# Altium schematic sheet LED 7 Thanh.SchDoc
size A
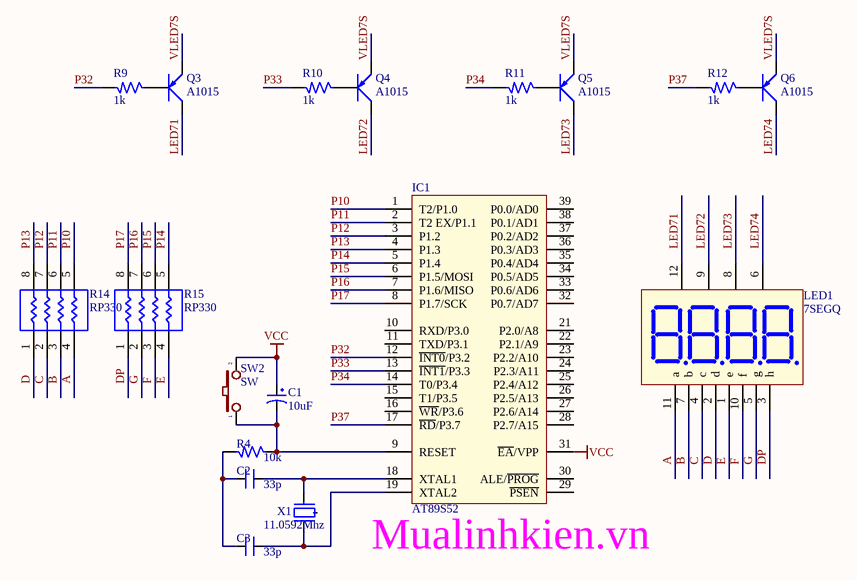
[diagram p0: LED 7 Thanh.SchDoc]

## Parts
C1  10uF  [CP1/2]
C2  33p  [SM-0805]
C3  33p  [SM-0805]
IC1  AT89S52  [ZIP40]
LED1  7SEGQ  [7SEGQ-n]
Q3  A1015  [SOT23B]
Q4  A1015  [SOT23B]
Q5  A1015  [SOT23B]
Q6  A1015  [SOT23B]
R4  10k  [SM-RES-0805]
R9  1k  [SM-RES-0805]
R10  1k  [SM-RES-0805]
R11  1k  [SM-RES-0805]
R12  1k  [SM-RES-0805]
R14  RP330  [RESCAXS50P160X320X70-8N]
R15  RP330  [RESCAXS50P160X320X70-8N]
SW2  SW  [SW-SMD]
X1  11.0592Mhz  [XT3]

## Nets
GND: IC1.20(GND)
VCC: C1.1 IC1.31(~{EA}/VPP) IC1.40(VCC) SW2.2
A: LED1.11(a) R14.4
B: LED1.7(b) R14.3
C: LED1.4(c) R14.2
D: LED1.2(d) R14.1
DP: LED1.3(h) R15.1
E: LED1.1(e) R15.4
F: LED1.10(f) R15.3
G: LED1.5(g) R15.2
LED71: LED1.12(V1) Q3.2(C)
LED72: LED1.9(V2) Q4.2(C)
LED73: LED1.8(V3) Q5.2(C)
LED74: LED1.6(V4) Q6.2(C)
P10: IC1.1(T2/P1.0) R14.5
P11: IC1.2(T2_EX/P1.1) R14.6
P12: IC1.3(P1.2) R14.7
P13: IC1.4(P1.3) R14.8
P14: IC1.5(P1.4) R15.5
P15: IC1.6(P1.5/MOSI) R15.6
P16: IC1.7(P1.6/MISO) R15.7
P17: IC1.8(P1.7/SCK) R15.8
P32: IC1.12(~{INT0}/P3.2) R9.2
P33: IC1.13(~{INT1}/P3.3) R10.2
P34: IC1.14(T0/P3.4) R11.2
P37: IC1.17(~{RD}/P3.7) R12.2
VLED7S: Q3.1(E) Q4.1(E) Q5.1(E) Q6.1(E)
NetC1_2: C1.2 IC1.9(RESET) R4.1 SW2.1
NetC2_1: C2.1 C3.1 R4.2
NetC2_2: C2.2 IC1.18(XTAL1) X1.2
NetC3_2: C3.2 IC1.19(XTAL2) X1.1
NetQ3_3: Q3.3(B) R9.1
NetQ4_3: Q4.3(B) R10.1
NetQ5_3: Q5.3(B) R11.1
NetQ6_3: Q6.3(B) R12.1

Not connected (* = marked no-connect by the designer): IC1 10(RXD/P3.0) 11(TXD/P3.1) 15(T1/P3.5) 16(~{WR}/P3.6) 21(P2.0/A8) 22(P2.1/A9) 23(P2.2/A10) 24(P2.3/A11) 25(P2.4/A12) 26(P2.5/A13) 27(P2.6/A14) 28(P2.7/A15) 29(~{PSEN}) 30(ALE/~{PROG}) 32(P0.7/AD7) 33(P0.6/AD6) 34(P0.5/AD5) 35(P0.4/AD4) 36(P0.3/AD3) 37(P0.2/AD2) 38(P0.1/AD1) 39(P0.0/AD0); X1 3

## Notes on the sheet
- Labels drawn without touching a wire or pin: Mualinhkien.vn

## Library data of the parts
C1 = CP1: Cap P  0,1uF < 22uF , 16 - 50V; Value: 10uF/50V; Description 1: 10 => 220uF/6,3V/10V - 10uF => 100uF/16V; Description 2: 0,1uF => 33uF/50V - 10uF => 22uF/63V; Description 3: 0,47uF => 10uF/100V
C2 C3 = CN1: Cap np  1pF - 472pF; Value: 100pF
IC1 = AT89S52: AT89S52, 8k Byte Flash Memory , 40 Pin; Value: AT89S52
LED1 = LED7Q: Four 7 Seg Dipslay; Value: LED 7Q SEG
Q3-Q6 = A1015: PNP 600mW, ECB; Value: A1015
R4 R9-R12 = R: Resistor 1/4W; Value: R1/4W - 1K
R14 R15 = ResPack
SW2 = SW2: Switch button 2 pin; Value: SW chip 2 pin
X1 = XT3: Crystal For all Crystal 2pin.; Value: 4Mhz